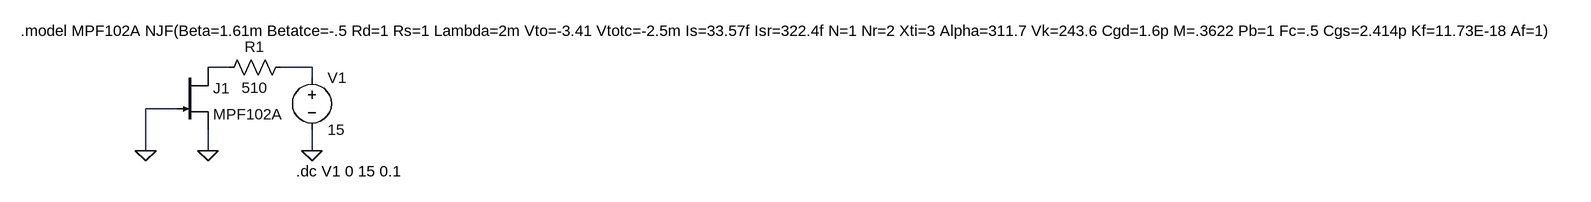
[diagram p0: schematic Sim-Idss.asc]
Sim-Idss.asc, the LTspice schematic file:
Version 4.1
SHEET 1 2632 680
WIRE 160 96 128 96
WIRE 288 96 240 96
WIRE 288 112 288 96
WIRE 80 160 32 160
WIRE 32 224 32 160
WIRE 128 224 128 192
WIRE 288 224 288 192
FLAG 32 224 0
FLAG 128 224 0
FLAG 288 224 0
SYMBOL njf 80 96 R0
SYMATTR InstName J1
SYMATTR Value MPF102A
SYMBOL voltage 288 96 R0
WINDOW 123 0 0 Left 0
WINDOW 39 0 0 Left 0
SYMATTR InstName V1
SYMATTR Value 15
SYMBOL res 256 80 R90
WINDOW 0 0 56 VBottom 2
WINDOW 3 32 56 VTop 2
SYMATTR InstName R1
SYMATTR Value 510
TEXT -160 40 Left 2 !.model MPF102A NJF(Beta=1.61m Betatce=-.5 Rd=1 Rs=1 Lambda=2m Vto=-3.41 Vtotc=-2.5m Is=33.57f Isr=322.4f N=1 Nr=2 Xti=3 Alpha=311.7 Vk=243.6 Cgd=1.6p M=.3622 Pb=1 Fc=.5 Cgs=2.414p Kf=11.73E-18 Af=1)
TEXT 264 256 Left 2 !.dc V1 0 15 0.1

The netlist it stands for:
* Sim-Idss.asc
J1 N001 0 0 MPF102A
V1 N002 0 15
R1 N002 N001 510
.model NJF NJF
.model PJF PJF
.lib standard.jft
.model MPF102A NJF(Beta=1.61m Betatce=-.5 Rd=1 Rs=1 Lambda=2m Vto=-3.41 Vtotc=-2.5m Is=33.57f Isr=322.4f N=1 Nr=2 Xti=3 Alpha=311.7 Vk=243.6 Cgd=1.6p M=.3622 Pb=1 Fc=.5 Cgs=2.414p Kf=11.73E-18 Af=1)
.dc V1 0 15 0.1
.backanno
.end